# Altium schematic sheet Input_Output.SchDoc
size A; SheetNumber: 2; SheetTotal: 5
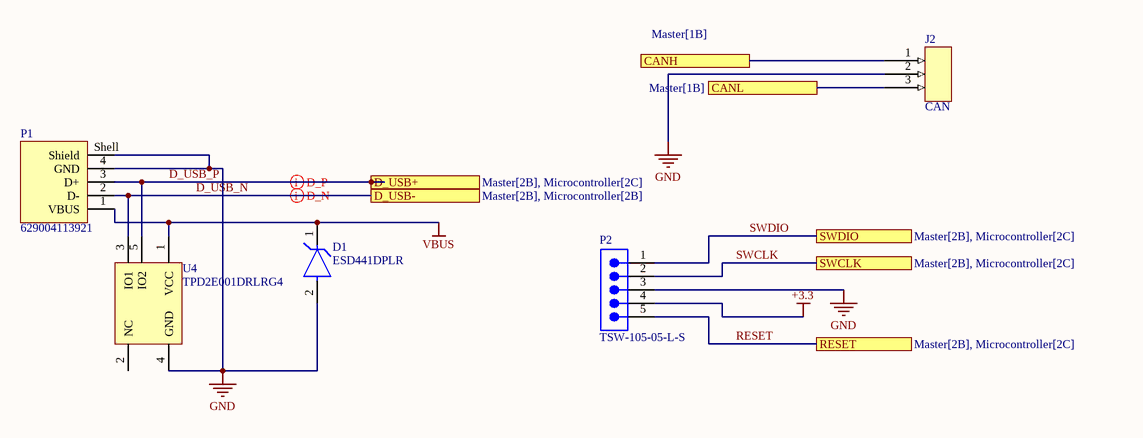
[diagram p0: Input_Output.SchDoc]

## Parts
D1  ESD441DPLR  [FP-DPL0002A-MFG]
J2  CAN  [3 pin 2.54mm header-Footprint-1]
P1  629004113921  [629004113921]
P2  TSW-105-05-L-S  [SMTC-TSW-105-05-X-S]
U4  TPD2E001DRLRG4  [DRL0005A_L]

## Ports
CANH (see Master[1B]), CANL (see Master[1B]), D_USB+ (see Master[2B], Microcontroller[2C]), D_USB- (see Master[2B], Microcontroller[2B]), RESET (see Master[2B], Microcontroller[2C]), SWCLK (see Master[2B], Microcontroller[2C]), SWDIO (see Master[2B], Microcontroller[2C])

## Nets
+3.3: P2.4
GND: D1.2(GND) J2.2 P1.4(GND) P1.Shell(Shield) P2.3 U4.4(GND)
VBUS: D1.1(IO) P1.1(VBUS) U4.1(VCC)
CANH: J2.1 ; port CANH
CANL: J2.3 ; port CANL
D_USB_N: P1.2(D-) U4.3(IO1) ; port D_USB-
D_USB_P: P1.3(D+) U4.5(IO2) ; port D_USB+
RESET: P2.5 ; port RESET
SWCLK: P2.2 ; port SWCLK
SWDIO: P2.1 ; port SWDIO

Not connected (* = marked no-connect by the designer): U4 2(NC)

## Layout directives
differential pair: D_USB_N, D_USB_P

## Library data of the parts
D1 = CMP-00370-140306675-1: ESD441DPLR 1-pF, 5.5-V, 30-KV ESD protection device in 0201 package 2-X2SON -40 to 125; Manufacturer Lifecycle Status: ACTIVE; Number of Channels: 1; Breakdown Voltage: 6V; Capacitance: 1pF; Peak Pulse Current: 6A; Direction: Unidirectional; Peak Pulse Power: 45W; Reverse Standoff Voltage: 5.5V; Clamping Voltage: 3.8V; Lifecycle Status: Production; Length: 600µm; Height: 320µm; Max Operating Temperature: 125°C; Width: 300µm; Number of Pins: 2; Ambient Temperature Range High: 150°C; Min Operating Temperature: -40°C; Thickness: 300µm; NexarPartId: 140306675
J2 = CMP-002-00074-2: 3 pin header for jumpers connectors 2.54mm pitch.
P1 = CMP-1502-03242-2: NexarPartId: 19991169; USB Standard: USB 2.0; Gender: Male; Connector Type: USB; Contact Resistance: 20mΩ; Current Rating: 1.5A; Number of Contacts: 4; Insulation Resistance: 1GΩ; Operating Supply Voltage: 30V; Termination: SMD/SMT; Lead Free: Lead Free; Max Operating Temperature: 105°C; Mount: Horizontal, Surface Mount; Features: Shielded; Orientation: Horizontal; Length: 18.8mm; REACH SVHC: Unknown; Min Operating Temperature: -40°C; Contact Plating: Gold; Number of Pins: 4; RoHS: Compliant
P2 = CMP-1024-00366-1: 0.025" SQ Post Header, Through-hole, Vertical, -55 to 125 degC, 2.54 mm Pitch, 5-Pin, Male, RoHS; Manufacturer: Samtec; Pitch: 2.54 mm; PackageVersion: DM, 8/1988; PartNumber: TSW-105-05-L-S; Orientation: Vertical; Temperature Range: -55 to 125 degC; ComponentLink1Description: Manufacturer URL; PackageDescription: .025[0.64] SQ. Post Terminal Strip Assembly; ComponentLink2URL: http://www.samtec.com/documents/webfiles/pdf/TSW_TH.PDF; PackageReference: TSW-105-05-X-S; ComponentLink2Description: Datasheet; Mounting Technology: Through-hole; DatasheetVersion: F-214; ComponentLink1URL: http://www.samtec.com; RoHS: True; ComponentLink3URL: http://www.samtec.com/documents/webfiles/cpdf/TSW-XXX-XX-XXX-X-XX-XXX-MKT.pdf; ComponentLink3Description: Package Specification
U4 = CMP-0326-00050-2: Low-Capacitance + / - 15 kV ESD-Protection Array for High-Speed Data Interfaces, 2 Channels, -40 to +85 degC, 5-pin SOT (DRL), Green (RoHS & no Sb/Br); Manufacturer: Texas Instruments; USB High Speed: TRUE; IO Leakage Current(nA): 1; IEC 61000-4-2 Contact(+/- kV): 8; Breakdown Voltage(Min)(V): 11; IEC 61000-4-2 Air-Gap(+/- kV): 15; IO Capacitance(Typ)(pF): 1.5; SubFamily: ESD Solution; Eco-Plan: Green (RoHS & no Sb/Br); PackageDescription: 5-Pin Plastic Small Outline, Flat Lead 0.5 mm Pitch; ComponentLink2Description: Datasheet; ComponentLink3URL: SamplesURL:http://www.ti.com/product/tpd2e001#samples; ComponentLink1URL: http://www.ti.com/; PartNumber: TPD2E001DRLRG4; DatasheetVersion: SLLS684F; PackageVersion: revD, Aug-2007; PackageReference: DRL0005A; ComponentLink2URL: http://www.ti.com/general/docs/lit/getliterature.tsp?genericPartNumber=TPD2E001&fileType=pdf; Mounting Technology: Surface Mount; ComponentLink1Description: Manufacturer URL; ComponentLink3Description: URL Link1